# Altium schematic sheet Counter.SchDoc
size A4; ApprovedBy: Mateusz Kowalik; CheckedBy: Mateusz Kowalik; Author: Mateusz Kowalik; CompanyName: InMotion Labs sp. z o.o.; DrawnBy: Mateusz Kowalik; Engineer: Mateusz Kowalik; Organization: InMotion Labs sp. z o.o.; Address1: Rydlówka 5A; Address2: 30-363 Kraków; Address4: Poland; DocumentNumber: 14; Revision: Rev 0; SheetNumber: 14; SheetTotal: 17
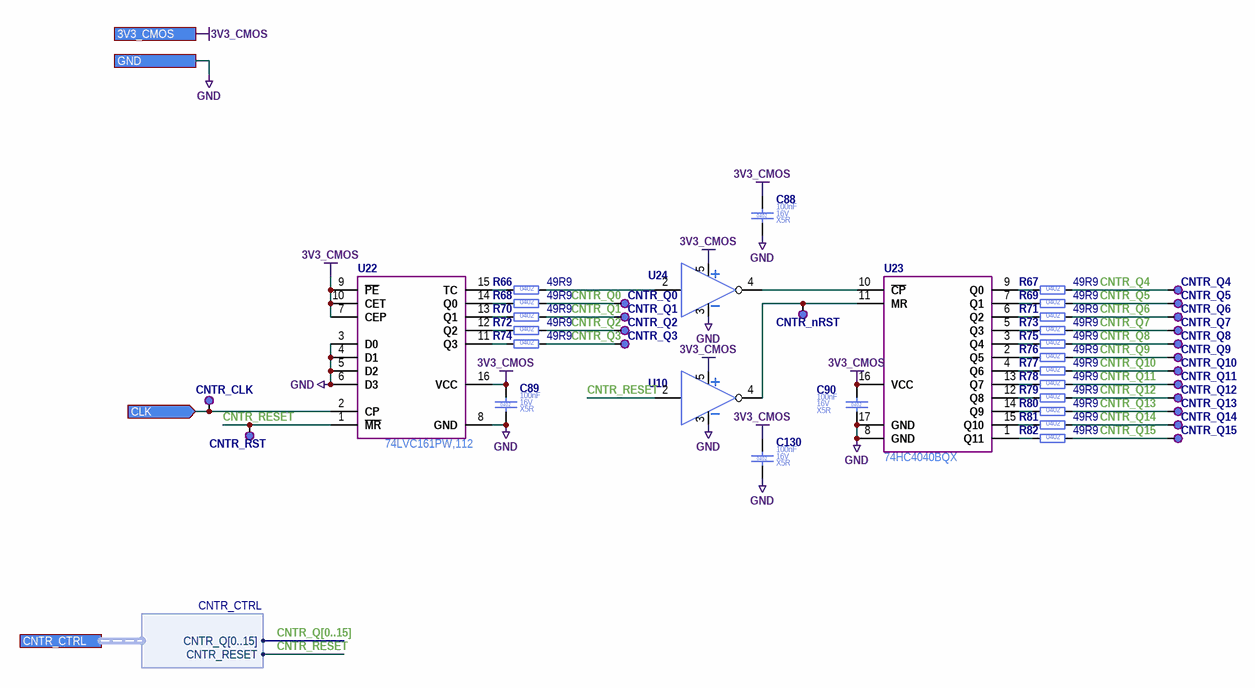
[diagram p0: Counter.SchDoc]

## Parts
C88  Case/Package: 0402  Voltage Rating (DC): 16V  Dielectric: X5R  Capacitance: 100nF  [C_0402_1005]  (hidden comment: C_100NF_16V_X5R_0402_10)
C89  Case/Package: 0402  Voltage Rating (DC): 16V  Dielectric: X5R  Capacitance: 100nF  [C_0402_1005]  (hidden comment: C_100NF_16V_X5R_0402_10)
C90  Case/Package: 0402  Voltage Rating (DC): 16V  Dielectric: X5R  Capacitance: 100nF  [C_0402_1005]  (hidden comment: C_100NF_16V_X5R_0402_10)
C130  Case/Package: 0402  Voltage Rating (DC): 16V  Dielectric: X5R  Capacitance: 100nF  [C_0402_1005]  (hidden comment: C_100NF_16V_X5R_0402_10)
CNTR_CLK  TP_PAD_1.3MM  [TP_PAD_1.3MM]  (value not drawn)  (no BOM)
CNTR_nRST  TP_PAD_1.3MM  [TP_PAD_1.3MM]  (value not drawn)  (no BOM)
CNTR_Q0  TP_PAD_1.3MM  [TP_PAD_1.3MM]  (value not drawn)  (no BOM)
CNTR_Q1  TP_PAD_1.3MM  [TP_PAD_1.3MM]  (value not drawn)  (no BOM)
CNTR_Q2  TP_PAD_1.3MM  [TP_PAD_1.3MM]  (value not drawn)  (no BOM)
CNTR_Q3  TP_PAD_1.3MM  [TP_PAD_1.3MM]  (value not drawn)  (no BOM)
CNTR_Q4  TP_PAD_1.3MM  [TP_PAD_1.3MM]  (value not drawn)  (no BOM)
CNTR_Q5  TP_PAD_1.3MM  [TP_PAD_1.3MM]  (value not drawn)  (no BOM)
CNTR_Q6  TP_PAD_1.3MM  [TP_PAD_1.3MM]  (value not drawn)  (no BOM)
CNTR_Q7  TP_PAD_1.3MM  [TP_PAD_1.3MM]  (value not drawn)  (no BOM)
CNTR_Q8  TP_PAD_1.3MM  [TP_PAD_1.3MM]  (value not drawn)  (no BOM)
CNTR_Q9  TP_PAD_1.3MM  [TP_PAD_1.3MM]  (value not drawn)  (no BOM)
CNTR_Q10  TP_PAD_1.3MM  [TP_PAD_1.3MM]  (value not drawn)  (no BOM)
CNTR_Q11  TP_PAD_1.3MM  [TP_PAD_1.3MM]  (value not drawn)  (no BOM)
CNTR_Q12  TP_PAD_1.3MM  [TP_PAD_1.3MM]  (value not drawn)  (no BOM)
CNTR_Q13  TP_PAD_1.3MM  [TP_PAD_1.3MM]  (value not drawn)  (no BOM)
CNTR_Q14  TP_PAD_1.3MM  [TP_PAD_1.3MM]  (value not drawn)  (no BOM)
CNTR_Q15  TP_PAD_1.3MM  [TP_PAD_1.3MM]  (value not drawn)  (no BOM)
CNTR_RST  TP_PAD_1.3MM  [TP_PAD_1.3MM]  (value not drawn)  (no BOM)
R66  Resistance: 49R9  Case/Package: 0402  [R_0402_1005]  (hidden comment: R_49R9_0402_1)
R67  Resistance: 49R9  Case/Package: 0402  [R_0402_1005]  (hidden comment: R_49R9_0402_1)
R68  Resistance: 49R9  Case/Package: 0402  [R_0402_1005]  (hidden comment: R_49R9_0402_1)
R69  Resistance: 49R9  Case/Package: 0402  [R_0402_1005]  (hidden comment: R_49R9_0402_1)
R70  Resistance: 49R9  Case/Package: 0402  [R_0402_1005]  (hidden comment: R_49R9_0402_1)
R71  Resistance: 49R9  Case/Package: 0402  [R_0402_1005]  (hidden comment: R_49R9_0402_1)
R72  Resistance: 49R9  Case/Package: 0402  [R_0402_1005]  (hidden comment: R_49R9_0402_1)
R73  Resistance: 49R9  Case/Package: 0402  [R_0402_1005]  (hidden comment: R_49R9_0402_1)
R74  Resistance: 49R9  Case/Package: 0402  [R_0402_1005]  (hidden comment: R_49R9_0402_1)
R75  Resistance: 49R9  Case/Package: 0402  [R_0402_1005]  (hidden comment: R_49R9_0402_1)
R76  Resistance: 49R9  Case/Package: 0402  [R_0402_1005]  (hidden comment: R_49R9_0402_1)
R77  Resistance: 49R9  Case/Package: 0402  [R_0402_1005]  (hidden comment: R_49R9_0402_1)
R78  Resistance: 49R9  Case/Package: 0402  [R_0402_1005]  (hidden comment: R_49R9_0402_1)
R79  Resistance: 49R9  Case/Package: 0402  [R_0402_1005]  (hidden comment: R_49R9_0402_1)
R80  Resistance: 49R9  Case/Package: 0402  [R_0402_1005]  (hidden comment: R_49R9_0402_1)
R81  Resistance: 49R9  Case/Package: 0402  [R_0402_1005]  (hidden comment: R_49R9_0402_1)
R82  Resistance: 49R9  Case/Package: 0402  [R_0402_1005]  (hidden comment: R_49R9_0402_1)
U10  SN74AHC1G04DBVR  [SOT23-5_SC74A_SOT753_M]  (value not drawn)
U22  74LVC161PW,112  [TSOP65P640X120-16N]
U23  74HC4040BQX  [QFN50P350X250X100_HS-17N]
U24  SN74AHC1G04DBVR  [SOT23-5_SC74A_SOT753_M]  (value not drawn)

## Ports
3V3_CMOS, CLK (in), CNTR_CTRL (harness CNTR_CTRL), GND

## Harnesses
CNTR_CTRL: CNTR_Q[0..15], CNTR_RESET

## Nets
3V3_CMOS: C88.1 C89.1 C90.1 C130.1 U10.5(VCC) U22.7(CEP) U22.9(~{PE}) U22.10(CET) U22.16(VCC) U23.16(VCC) U24.5(VCC) ; port 3V3_CMOS
GND: C88.2 C89.2 C90.2 C130.2 U10.3(GND) U22.3(D0) U22.4(D1) U22.5(D2) U22.6(D3) U22.8(GND) U23.8(GND) U23.17(GND) U24.3(GND) ; port GND
CLK: CNTR_CLK.1(TP) U22.2(CP) ; port CLK
CNTR_Q0: CNTR_Q0.1(TP) R68.2
CNTR_Q1: CNTR_Q1.1(TP) R70.2
CNTR_Q2: CNTR_Q2.1(TP) R72.2
CNTR_Q3: CNTR_Q3.1(TP) R74.2
CNTR_Q4: CNTR_Q4.1(TP) R67.2
CNTR_Q5: CNTR_Q5.1(TP) R69.2
CNTR_Q6: CNTR_Q6.1(TP) R71.2
CNTR_Q7: CNTR_Q7.1(TP) R73.2
CNTR_Q8: CNTR_Q8.1(TP) R75.2
CNTR_Q9: CNTR_Q9.1(TP) R76.2
CNTR_Q10: CNTR_Q10.1(TP) R77.2
CNTR_Q11: CNTR_Q11.1(TP) R78.2
CNTR_Q12: CNTR_Q12.1(TP) R79.2
CNTR_Q13: CNTR_Q13.1(TP) R80.2
CNTR_Q14: CNTR_Q14.1(TP) R81.2
CNTR_Q15: CNTR_Q15.1(TP) R82.2
CNTR_RESET: CNTR_RST.1(TP) U10.2 U22.1(~{MR}) ; port CNTR_CTRL.CNTR_RESET
NetCNTR_nRST_1: CNTR_nRST.1(TP) U10.4(OutY) U23.11(MR)
NetR66_1: R66.1 U22.15(TC)
NetR66_2: R66.2 U24.2
NetR67_1: R67.1 U23.9(Q0)
NetR68_1: R68.1 U22.14(Q0)
NetR69_1: R69.1 U23.7(Q1)
NetR70_1: R70.1 U22.13(Q1)
NetR71_1: R71.1 U23.6(Q2)
NetR72_1: R72.1 U22.12(Q2)
NetR73_1: R73.1 U23.5(Q3)
NetR74_1: R74.1 U22.11(Q3)
NetR75_1: R75.1 U23.3(Q4)
NetR76_1: R76.1 U23.2(Q5)
NetR77_1: R77.1 U23.4(Q6)
NetR78_1: R78.1 U23.13(Q7)
NetR79_1: R79.1 U23.12(Q8)
NetR80_1: R80.1 U23.14(Q9)
NetR81_1: R81.1 U23.15(Q10)
NetR82_1: R82.1 U23.1(Q11)
NetU23_10: U23.10(~{CP}) U24.4(OutY)

Not connected (* = marked no-connect by the designer): U10 1(NC); U24 1(NC)

## Buses and harness runs
bus CNTR_Q[0..15]

## Notes on the sheet
- Title
- Size:
- Date:
- A4

## Library data of the parts
C88-C90 C130 = C_100NF_16V_X5R_0402_10: Ceramic Capacitor; Manufacturer Part Number: EMK105BJ104KV-F; Manufacturer: Taiyo Yuden; Value: 100nF; Tolerance: 10%; Part Number: C_100NF_16V_X5R_0402_10; Mount: Surface Mount; Height: 500um; HelpURL: http://datasheet.octopart.com/EMK105BJ104KV-F-Taiyo-Yuden-datasheet-8857305.pdf; RoHS: Compliant; Max Operating Temperature: 125°C; Status: MK; Supplier 1: Mouser; Supplier Part Number 1: 963-EMK105BJ104KV-F; Manufacturer 2: Samsung Electro-Mechanics; Manufacturer Part Number 2: CL05B104KO5NNNC; Supplier 2: LCSC; Supplier Part Number 2: C1525
CNTR_CLK CNTR_nRST CNTR_Q0-CNTR_Q15 CNTR_RST = TP_PAD_1.3MM: Testpoint SMD 1.3mm; Part Number: TP_PAD_1.3MM; Case/Package: SMD; Length: 0mm
R66-R82 = R_49R9_0402_1: Thick Film Resistor; Manufacturer: Yageo; Manufacturer Part Number: RC0402FR-0749R9L; Value: 49R9; Tolerance: 1%; Voltage Rating (DC): 50V; Power Rating: 63mW; Stats: MK; Part Number: R_49R9_0402_1; Mount: Surface Mount; Height: 350um; HelpURL: https://pl.mouser.com/datasheet/2/447/PYu_RC_Group_51_RoHS_L_10-1664068.pdf; RoHS: Compliant; Max Operating Temperature: 155°C; Supplier 1: Mouser; Supplier Part Number 1: 603-RC0402FR-0749R9L; Manufacturer 2: Uniroyal Elec; Manufacturer Part Number 2: 0402WGF499JTCE; Supplier 2: LCSC; Supplier Part Number 2: C25120
U10 U24 = SN74AHC1G04DBVR: Inverters Single; Manufacturer: Texas Instruments; Output Current: 25mA; Max Output Current: 50mA; Max Supply Voltage: 5.5V; Min Supply Voltage: 2V; Part Number: SN74AHC1G04DBVR; Case/Package: SOT-23; Mount: Surface Mount; Height: 1.1mm; HelpURL: http://www.ti.com/lit/ds/symlink/sn74ahc1g04.pdf; Max Operating Temperature: 125°C; RoHS: Compliant; Status: AK; Manufacturer Part Number: SN74AHC1G04DBVR
U22 = 74LVC161PW,112: 4 bit Counter with preset; Manufacturer: Nexperia; Output Current: 50mA; Max Supply Voltage: 3.6V; Min Supply Voltage: 1.65V; Part Number: 74LVC161PW,112; Case/Package: TSSOP16; Max Output Current: 50mA; Mount: Surface Mount; Height: 1.1mm; HelpURL: https://pl.mouser.com/datasheet/2/916/74LVC161-1319465.pdf; Max Operating Temperature: 125°C; RoHS: Compliant; Status: MK; Manufacturer Part Number: 74LVC161PW,112; Supplier 1: Mouser; Supplier Part Number 1: 771-LVC161PW112
U23 = 74HC4040BQX: 12 bit binary ripple counter; Manufacturer: Nexperia; Output Current: 25mA; Max Supply Voltage: 5.5V; Min Supply Voltage: 2.7V; Manufacturer Part Number: 74HC4040BQX; Part Number: 74HC4040BQX; Case/Package: DHVQFN16; Max Output Current: 25mA; Mount: Surface Mount; Height: 1mm; HelpURL: https://pl.mouser.com/datasheet/2/916/74HC_HCT4040-1319793.pdf; Max Operating Temperature: 125°C; RoHS: Compliant; Status: MK; Supplier 1: Mouser; Supplier Part Number 1: 771-74HC4040BQX